# EAGLE schematic Scorching-Speothos.postroute (EAGLE 7.0.0)

## Sheet 1 of 11
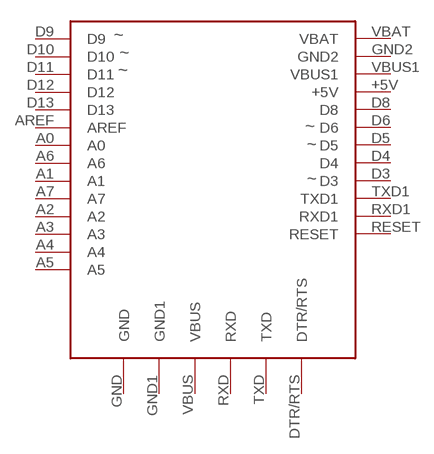
[diagram p0: schematic, sheet 1]

### Parts
U4  ADAFRUIT-PRO-TRINKET-5V-BOB  [ADAFRUIT-PRO-TRINKET-5V]

### Nets
+5V_0_brain: U4.+5V ; also sheet 3,7,8
A0_0_brain: U4.A0 ; also sheet 8
A1_0_brain: U4.A1
A2_0_brain: U4.A2
A3_0_brain: U4.A3
A4_0_brain: U4.A4 ; also sheet 3
A5_0_brain: U4.A5 ; also sheet 3
A6_0_brain: U4.A6
A7_0_brain: U4.A7
AREF_0_brain: U4.AREF
D3_0_brain: U4.D3 ; also sheet 7
D4_0_brain: U4.D4 ; also sheet 7
D5_0_brain: U4.D5 ; also sheet 7
D6_0_brain: U4.D6 ; also sheet 7
D8_0_brain: U4.D8 ; also sheet 7
D9_0_brain: U4.D9 ; also sheet 7
D10_0_brain: U4.D10 ; also sheet 7
D11_0_brain: U4.D11 ; also sheet 9
D12_0_brain: U4.D12 ; also sheet 10
D13_0_brain: U4.D13 ; also sheet 11
DTR/RTS_0_brain: U4.DTR/RTS
GND_0_brain: U4.GND U4.GND1 U4.GND2 ; also sheet 2,3,7,8,9,10,11
POS_1_battery: U4.VBAT ; also sheet 2,7
RESET_0_brain: U4.RESET
RXD1_0_brain: U4.RXD1
RXD_0_brain: U4.RXD
TXD1_0_brain: U4.TXD1
TXD_0_brain: U4.TXD
VBUS1_0_brain: U4.VBUS1
VBUS_0_brain: U4.VBUS

## Sheet 2 of 11
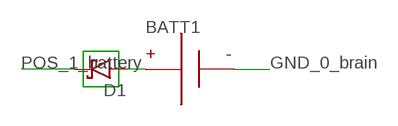
[diagram p1: schematic, sheet 2]

### Parts
BATT1  BATTERY-9V-VERTICAL  [BATTERY_9V_KEYSTONE_968]
D1  RESOLVED-DIODE-SCHOTTKY_TH-DO-41-AND-DO-204AL  [DIOAD1125W78L520D270_HS]

### Nets
GND_0_brain: BATT1.N ; also sheet 1,3,7,8,9,10,11
N$1_1_battery: BATT1.P D1.A
POS_1_battery: D1.C ; also sheet 1,7

## Sheet 3 of 11
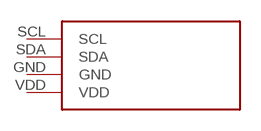
[diagram p2: schematic, sheet 3]

### Parts
U7  ADAFRUIT-1.2IN-8X8-LED-BACKPACK-WHITE  [ADAFRUIT-1.2IN-8X8-LED-BACKPACK]

### Nets
+5V_0_brain: U7.VDD ; also sheet 1,7,8
A4_0_brain: U7.SDA ; also sheet 1
A5_0_brain: U7.SCL ; also sheet 1
GND_0_brain: U7.GND ; also sheet 1,2,7,8,9,10,11

## Sheet 4 of 11
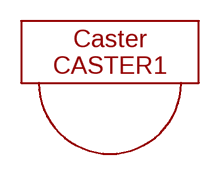
[diagram p3: schematic, sheet 4]

### Parts
CASTER1  CASTERADAFRUIT-3/4IN  [ADAFRUIT-3/4IN-CASTER]

## Sheet 5 of 11
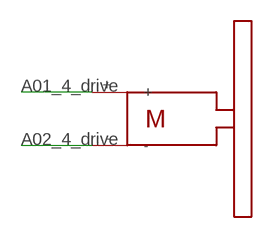
[diagram p4: schematic, sheet 5]

### Parts
U1  SOLARBOTICS_GM2SPARKFUN_HOBBY  [SPARKFUN_HOBBY_MOTOR]

### Nets
A01_4_drive: U1.+ ; also sheet 7
A02_4_drive: U1.- ; also sheet 7

## Sheet 6 of 11
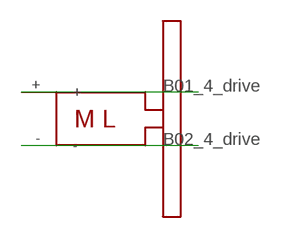
[diagram p5: schematic, sheet 6]

### Parts
U2  SOLARBOTICS_GM2_LEFTSPARKFUN_HOBBY  [SPARKFUN_HOBBY_MOTOR_LEFT]

### Nets
B01_4_drive: U2.+ ; also sheet 7
B02_4_drive: U2.- ; also sheet 7

## Sheet 7 of 11
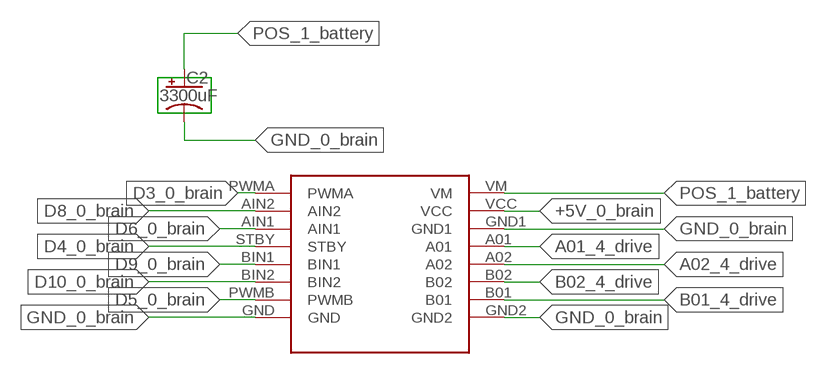
[diagram p6: schematic, sheet 7]

### Parts
C2  3300uF  RESOLVED-CAPACITOR-POL_TH-RADIAL_ALUMINUM_16MM  [CAPPRD750W80D1600H2200P]
U6  SPARKFUN_DUAL_MOTOR_DRIVER-BOB  [SPARKFUN_DUAL_MOTOR_DRIVER]

### Nets
+5V_0_brain: U6.VCC ; also sheet 1,3,8
A01_4_drive: U6.A01 ; also sheet 5
A02_4_drive: U6.A02 ; also sheet 5
B01_4_drive: U6.B01 ; also sheet 6
B02_4_drive: U6.B02 ; also sheet 6
D3_0_brain: U6.PWMA ; also sheet 1
D4_0_brain: U6.STBY ; also sheet 1
D5_0_brain: U6.PWMB ; also sheet 1
D6_0_brain: U6.AIN1 ; also sheet 1
D8_0_brain: U6.AIN2 ; also sheet 1
D9_0_brain: U6.BIN1 ; also sheet 1
D10_0_brain: U6.BIN2 ; also sheet 1
GND_0_brain: C2.2(-) U6.GND U6.GND1 U6.GND2 ; also sheet 1,2,3,8,9,10,11
POS_1_battery: C2.1(+) U6.VM ; also sheet 1,2

## Sheet 8 of 11
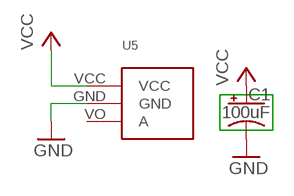
[diagram p7: schematic, sheet 8]

### Parts
C1  100uF  RESOLVED-CAPACITOR-POL_TH-RADIAL_ALUMINUM_6.3MM  [CAPPRD250W80D630H1220P]
U5  ANALOG_DISTANCE_SENSOR-GLUE  [ANALOG_DISTANCE_SENSOR_GLUE_MOUNT]

### Nets
+5V_0_brain: C1.1(+) U5.VCC ; supply symbol labelled VCC ; also sheet 1,3,7
A0_0_brain: U5.VO(A) ; also sheet 1
GND_0_brain: C1.2(-) U5.GND ; supply symbol labelled GND ; also sheet 1,2,3,7,9,10,11

## Sheet 9 of 11
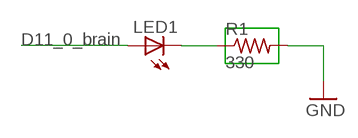
[diagram p8: schematic, sheet 9]

### Parts
LED1  LED-5MM-WHITE  [LED5MM]
R1  330  RESOLVED-RESISTOR_TH-1/6W-CARBON  [RESAD770W45L370D210_HS]

### Nets
D11_0_brain: LED1.A ; also sheet 1
GND_0_brain: R1.2 ; supply symbol labelled GND ; also sheet 1,2,3,7,8,10,11
N$1_6_led: LED1.K(C) R1.1

## Sheet 10 of 11
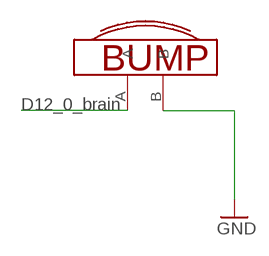
[diagram p9: schematic, sheet 10]

### Parts
U8  BUMP_SWITCH-MEDIUM-LEFT  [BUMP_SWITCH_OMRON_D2FLA]

### Nets
D12_0_brain: U8.A ; also sheet 1
GND_0_brain: U8.B ; supply symbol labelled GND ; also sheet 1,2,3,7,8,9,11

## Sheet 11 of 11
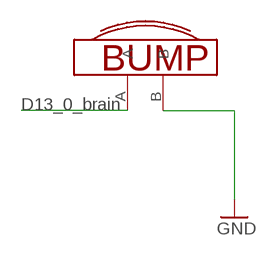
[diagram p10: schematic, sheet 11]

### Parts
U3  BUMP_SWITCH-MEDIUM-RIGHT  [BUMP_SWITCH_OMRON_D2FLA1]

### Nets
D13_0_brain: U3.A ; also sheet 1
GND_0_brain: U3.B ; supply symbol labelled GND ; also sheet 1,2,3,7,8,9,10

## Library data of the parts
BATT1 = Components:BATTERY; DIST: Digikey; DISTPN: 36-968-ND; HIERARCHY_NAME: battery.BATT1
C1 = KoalaBuild:RESOLVED-CAPACITOR-POL_: Polarized capacitor; DATASHEET: http://industrial.panasonic.com/www-cgi/jvcr13pz.cgi?E+PZ+3+ABA0012+ECA1EM101+7+WW; DATA_SHEET: http://industrial.panasonic.com/www-cgi/jvcr13pz.cgi?E+PZ+3+ABA0012+ECA1EM101+7+WW; DB: /Users/swanson/research/NVSL/src/with-git/gtron_devel/Gadgets/Tools/Koala/Koala/PartLibrary/Digikey/Capacitors-AluminumTH.csv; DEVICE: TH-RADIAL_ALUMINUM_6.3MM; DIST: Digikey; DISTPN: P5152-ND; HIERARCHY_NAME: distanceSensor.C1; IMAGE: http://media.digikey.com/Photos/Panasonic%20Photos/ECA-1EM101B.JPG; MFR: Panasonic Electronic Components; MIN_QTY: 1; MPN: ECA-1EM101; PACKAGE: CAPPRD250W80D630H1220P; PRICE: $0.25; SIZE: TH; STOCK: STOCK; TOL: 20%; VALUE_QUERY: >10uF; VOLTS: ( >= 5)V
C2 = KoalaBuild:RESOLVED-CAPACITOR-POL_: Polarized capacitor; DATASHEET: http://industrial.panasonic.com/www-cgi/jvcr13pz.cgi?E+PZ+3+ABA0012+ECA1EM332+7+WW; DATA_SHEET: http://industrial.panasonic.com/www-cgi/jvcr13pz.cgi?E+PZ+3+ABA0012+ECA1EM332+7+WW; DB: /Users/swanson/research/NVSL/src/with-git/gtron_devel/Gadgets/Tools/Koala/Koala/PartLibrary/Digikey/Capacitors-AluminumTH.csv; DEVICE: TH-RADIAL_ALUMINUM_16MM; DIST: Digikey; DISTPN: P5158-ND; HIERARCHY_NAME: drive.C1; IMAGE: http://media.digikey.com/Photos/Panasonic%20Photos/ECA-1CM472.jpg; MFR: Panasonic Electronic Components; MIN_QTY: 1; MPN: ECA-1EM332; PACKAGE: CAPPRD750W80D1600H2200P; PRICE: $1.13; SIZE: TH; STOCK: STOCK; TOL: 20%; VALUE_QUERY: >3000uF; VOLTS: ( >= 5)V
CASTER1 = Components:CASTER; DIST: Adafruit; DISTPN: 1200; HIERARCHY_NAME: caster.u1
D1 = KoalaBuild:RESOLVED-DIODE-SCHOTTKY_: Schottky diode; DATASHEET: http://www.st.com/web/en/resource/technical/document/datasheet/CD00001625.pdf; DATA_SHEET: http://www.st.com/web/en/resource/technical/document/datasheet/CD00001625.pdf; DB: /home/buildserver/gtron_devel/Gadgets/Tools/Koala/Koala/PartLibrary/Digikey/Schottky-Diodes-TH.csv; DEVICE: TH-DO-41-AND-DO-204AL; DIST: Digikey; DISTPN: 497-4547-1-ND; HIERARCHY_NAME: battery.D1; IMAGE: http://media.digikey.com/photos/STMicro%20Photos/1N5819.JPG; IRECT: 1A; MFR: STMicroelectronics; MIN_QTY: 1; MPN: 1N5817; PACKAGE: DIOAD1125W78L520D270_HS; PRICE: $0.57; SIZE: TH; STOCK: STOCK; VALUE: 450mV; VREV: 20V
LED1 = Components:LED: LED OSRAM: - CHIPLED LG R971, LG N971, LY N971, LG Q971, LY Q971, LO R971, LY R971 LH N974, LH R974 LS Q976, LO Q976, LY Q976 LO Q996 - Hyper CHIPLED LW Q18S LB Q993, LB Q99A, LB R99A - SideLED LS A670, LO A670, LY A670, LG A670, LP A670 LB A673, LV A673, LT A673, LW A673 LH A674 LY A675 LS A676, LA A676, LO A676, LY A676, LW A676 LS A679, LY A679, LG A679 - Hyper Micro SIDELED® LS Y876, LA Y876, LO Y876, LY Y876 LT Y87S - SmartLED LW L88C, LW L88S LB L89C, LB L89S, LG L890 LS L89K, LO L89K, LY L89K LS L896, LA L896, LO L896, LY L896 - TOPLED LS T670, LO T670, LY T670, LG T670, LP T670 LSG T670, LSP T670, LSY T670, LOP T670, LYG T670 LG T671, LOG T671, LSG T671 LB T673, LV T673, LT T673, LW T673 LH T674 LS T676, LA T676, LO T676, LY T676, LB T676, LH T676, LSB T676, LW T676 LB T67C, LV T67C, LT T67C, LS T67K, LO T67K, LY T67K, LW E67C LS E67B, LA E67B, LO E67B, LY E67B, LB E67C, LV E67C, LT E67C LW T67C LS T679, LY T679, LG T679 LS T770, LO T770, LY T770, LG T770, LP T770 LB T773, LV T773, LT T773, LW T773 LH T774 LS E675, LA E675, LY E675, LS T675 LS T776, LA T776, LO T776, LY T776, LB T776 LHGB T686 LT T68C, LB T68C - Hyper Mini TOPLED® LB M676 - Mini TOPLED Santana® LG M470 LS M47K, LO M47K, LY M47K Source: http://www.osram.convergy.de/; DIST: Adafruit; DISTPN: 754; HIERARCHY_NAME: led.LED1
R1 = KoalaBuild:RESOLVED-RESISTOR_: Resistor; CASE: TH; DATASHEET: http://www.yageo.com/NewPortal/yageodocoutput?fileName=/pdf/throughhole/Yageo_LR_CFR_2013.pdf; DATA_SHEET: http://www.yageo.com/NewPortal/yageodocoutput?fileName=/pdf/throughhole/Yageo_LR_CFR_2013.pdf; DB: /home/buildserver/gtron_devel/Gadgets/Tools/Koala/Koala/PartLibrary/Digikey/Resistors-TH.csv; DEVICE: TH-1/6W-CARBON; DIST: Digikey; DISTPN: 330EBK-ND; HIERARCHY_NAME: led.R1; IMAGE: http://media.digikey.com/Renders/Yageo%20Renders/CFR-12JR-330R.jpg; MFR: Yageo; MIN_QTY: 1; MPN: CFR-12JB-52-330R; PACKAGE: RESAD770W45L370D210_HS; PRICE: $0.10; PWR: 167mW; SIZE: TH; STOCK: STOCK; TOL: 5%; VALUE_QUERY: 330
U1 = Components:SOLARBOTICS_GM2; DIST: Sparkfun; DISTPN: 13258-assembly; HIERARCHY_NAME: drive.R
U2 = Components:SOLARBOTICS_GM2_LEFT; DIST: Sparkfun; DISTPN: 13258-assembly; HIERARCHY_NAME: drive.L
U3 = Components:BUMP_SWITCH; DIST: Digikey; DISTPN: SW842-ND; HIERARCHY_NAME: bump_2.U$2
U4 = BOBs:ADAFRUIT-PRO-TRINKET-5V: Adafruit Pro Trinket - 5V 16MHz; DIST: Adafruit; DISTPN: 2000; HIERARCHY_NAME: brain.U1
U5 = Components:ANALOG_DISTANCE_SENSOR; DIST: Pololu; DISTPN: 2450; HIERARCHY_NAME: distanceSensor.D1
U6 = BOBs:SPARKFUN_DUAL_MOTOR_DRIVER: SF Dual Motor Driver; DIST: Sparkfun; DISTPN: 9457; HIERARCHY_NAME: drive.DRVR
U7 = BOBs:ADAFRUIT-1.2IN-8X8-LED-BACKPACK: Adafruit 0.56in 4-Digit 7-Segment Display w/I2C Backpack; DIST: Adafruit; DISTPN: 1614; HIERARCHY_NAME: display.u1
U8 = Components:BUMP_SWITCH; DIST: Digikey; DISTPN: SW843-ND; HIERARCHY_NAME: bump.U$2